# EAGLE design Servo_Force_Sensor (EAGLE 9.4.0)
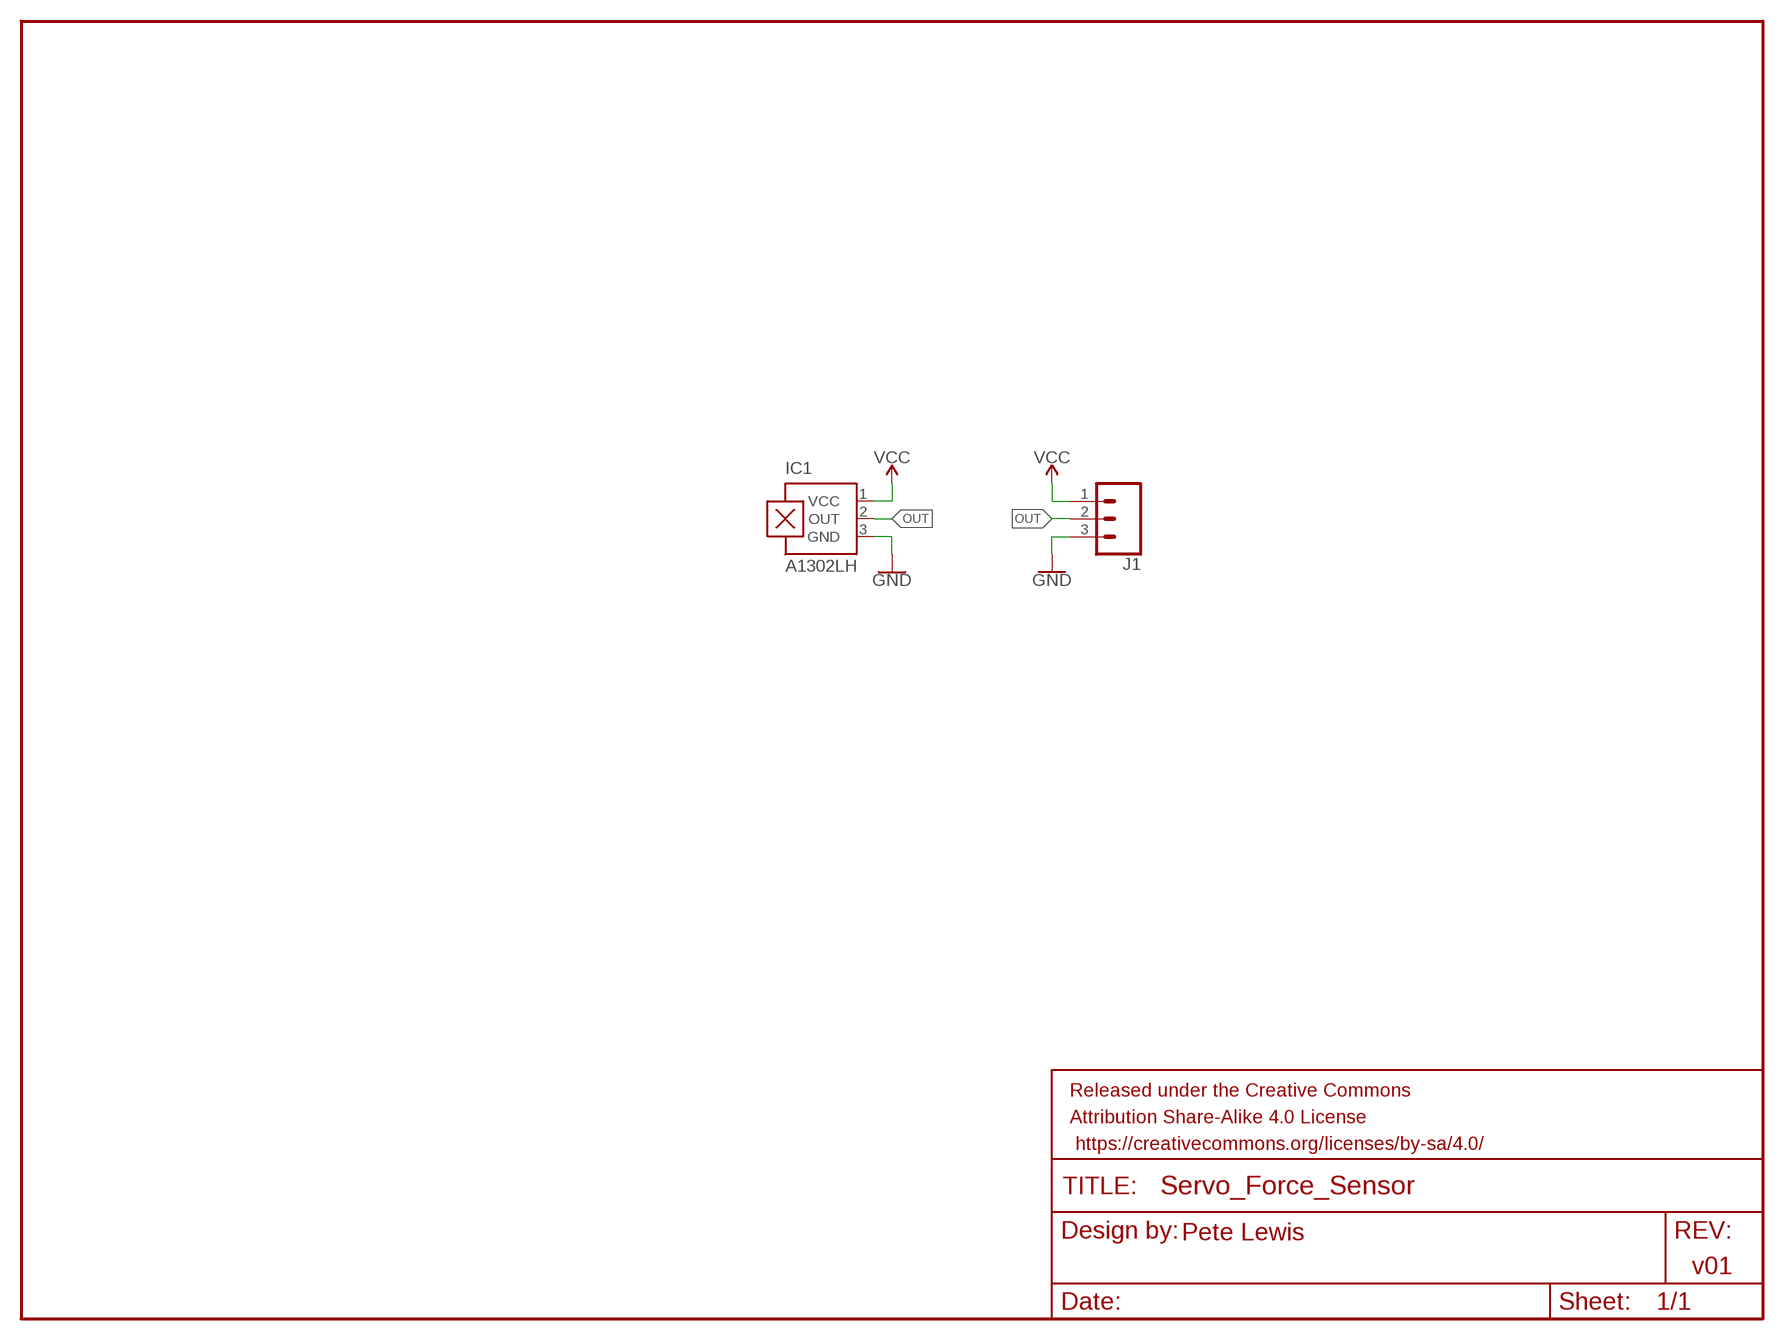
[diagram p0: schematic, sheet 1]

## Parts
FRAME1  FRAME-LETTER  [CREATIVE_COMMONS]
IC1  A1302LH  [SOT23-W]
J1  CONN_03LONGPADS  [1X03_LONGPADS]

## Nets
GND: IC1.3(GND) J1.3
OUT: IC1.2(OUT) J1.2
VCC: IC1.1(VCC) J1.1

## Notes on the sheet
- Pete Lewis
- v01

## Library data of the parts
FRAME1 = SparkFun-Aesthetics:FRAME-LETTER: Schematic Frame - Letter Standard 8.5x11 US Letter frame
IC1 = allegro:A13*?: Linear Hall Effect Sensor ICs Continuous-Time Ratiometric High-Temperature Operation Programmable Linear with Analog Output A1302 -Replacement- UGN3503 Source: http://www.allegromicro.com/en/Products/Part_Numbers/1301/1301.pdf http://www.allegromicro.com/en/Products/Part_Numbers/1321/1321.pdf http://www.allegromicro.com/en/Products/Part_Numbers/1381/1381.pdf; MF: ALLEGRO MICROSYSTEMS, INC.; MPN: A1302ELHLT-T; OC_FARNELL: 1457209; OC_NEWARK: 31K6638
J1 = SparkFun-Connectors:CONN_03: Multi connection point. Often used as Generic Header-pin footprint for 0.1 inch spaced/style header connections On any of the 0.1 inch spaced packages, you can populate with these: Break Away Headers - Straight <https://www.sparkfun.com/products/116> (PRT-00116) Break Away Male Headers - Right Angle <https://www.sparkfun.com/products/553> (PRT-00553) Female Headers <https://www.sparkfun.com/products/115> (PRT-00115) Break Away Headers - Machine Pin <https://www.sparkfun.com/products/117> (PRT-00117) Break Away Female Headers - Swiss Machine Pin <https://www.sparkfun.com/products/743> (PRT-00743) Stackable Header - 3 Pin (Female, 0.1") <https://www.sparkfun.com/products/13875> (PRT-13875) For SCREWTERMINALS and SPRING TERMINALS visit here: Screw Terimnals on SparkFun.com <https://www.sparkfun.com/search/results?term=Screw+Terminals> (5mm/3.5mm/2.54mm spacing) This device is also useful as a general connection point to wire up your design to another part of your project. Our various solder wires solder well into these plated through hole pads. Hook-Up Wire - Assortment (Stranded, 22 AWG) <https://www.sparkfun.com/products/11375> (PRT-11375) Hook-Up Wire - Assortment (Solid Core, 22 AWG) <https://www.sparkfun.com/products/11367> (PRT-11367) View the entire wire category on our website here <https://www.sparkfun.com/categories/141> Special notes: Molex polarized connector foot print use with SKU : PRT-08232 with associated crimp pins and housings.

## Board
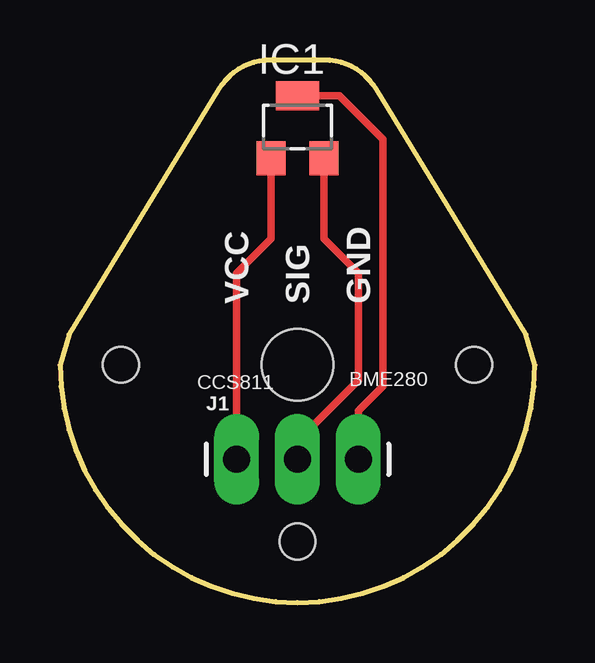
[diagram p1: board, top side]
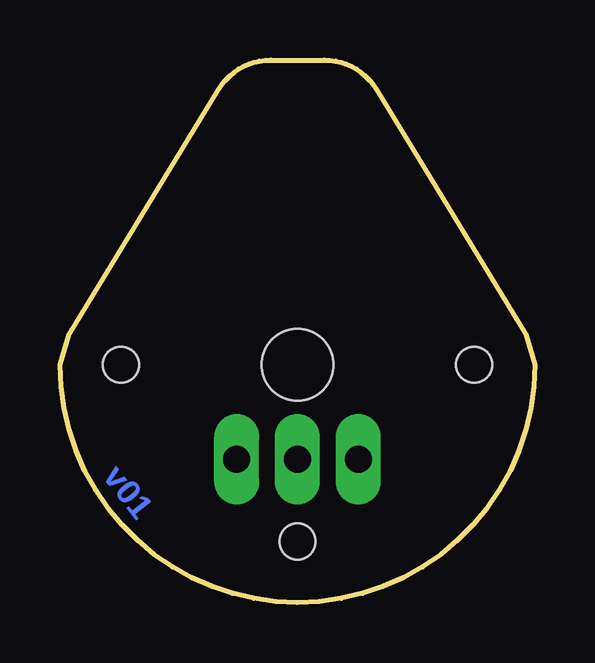
[diagram p2: board, bottom side, seen from below]

Size 19.81 x 22.61 mm. Coordinates in mm from the lower left corner, seen from the top.
Outline: 19.43,11.18 13.19,21.39 arc59 11.02,22.61 8.79,22.61 arc59 6.62,21.39 0.38,11.18 0,9.91 arc90 9.91,0 arc90 19.81,9.91 19.43,11.18
Copper layers (1*16): Top 0.035mm / dielectric 1.5mm / Bottom 0.035mm
Design rules "SparkFun-2-layer-TIGHT": minimum track width 7mil, minimum drill 15mil, track to track 7mil, track to pad 7mil, pad to pad 7mil, via to via 7mil, smd to smd 7mil, copper to edge 7mil, drill to drill 7mil, minimum pad ring 7mil, minimum via ring 7mil, stop-mask expansion 4mil, vias tented up to drill 25mil, thermal gap 10mil

### Footprints (pad centres in the part's own frame; a part is rotated, then mirrored left to right if it is on the bottom)
SOT23-W = smd 1.2 x 1.4: 1 -1.1,-1.3; 2 1.1,-1.3 | smd 1.8 x 1.2: 3 0,1.3
1X03_LONGPADS = drill 1.118 pad 1.88 long: 1 0,0; 2 2.54,0; 3 5.08,0
MEDIUM_HORN_16MM = hole 3: 0,0 | hole 1.5: -7.36,0; 7.36,0; 0,-7.36

### Placement (x,y rotation side)
FRAME1  -16.76,-23.11 0 top  (outside the outline)
IC1  9.91,19.81 0 top
J1  7.37,5.97 0 top
U$1  [MEDIUM_HORN_16MM]  9.91,9.91 0 top

### Tracks (layer width: path | path; a pad name or v marks a point on that pad's centre or on a via)
GND
  Top 0.305: J1.3 12.45,8 13.46,9.02 13.46,19.3 11.65,21.11 IC1.3
OUT
  Top 0.305: IC1.2 11.01,15.16 12.45,13.72 12.45,9.27 9.91,6.73 J1.2
VCC
  Top 0.305: IC1.1 8.81,15.16 7.37,13.72 J1.1

### Text on the board
Bottom: v01
tPlace: VCC | SIG | GND
tNames: BME280 | CCS811
Measures: Measurements in mm
tDocu: Pete Lewis